# Altium schematic sheet SH4 - 5V VICOR DCDC.SchDoc: 5V Vicor DCDC
size B; CheckedBy: Lance Bantoto; Engineer: Cindy Li; Organization: UW Robotics; Address1: 200 University Avenue; Address2: Waterloo; Address3: Ontario; Address4: Canada N2L 3G6; DocumentNumber: 4; Revision: 2; SheetNumber: 4; SheetTotal: 10
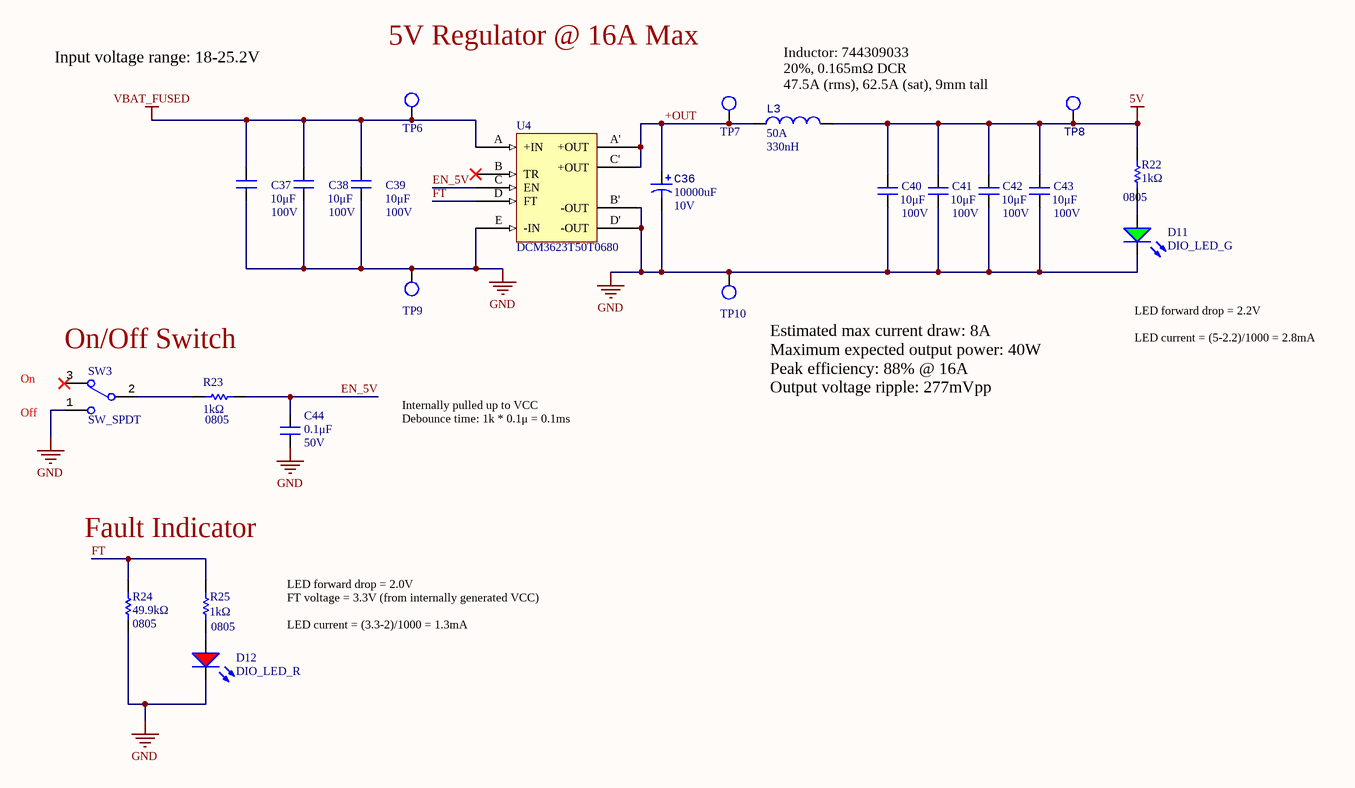
[diagram p0: SH4 - 5V VICOR DCDC.SchDoc]

## Parts
C36  Capacitance: 10000uF  Voltage Rating: 10V  [CAP_UBY_18X25_NC]  (hidden comment: URS1A103MHD1TN)
C37  value 10μF  Voltage Rating: 100V  [CAP1210]  (hidden comment: CAP_10uF_100V_1210)
C38  value 10μF  Voltage Rating: 100V  [CAP1210]  (hidden comment: CAP_10uF_100V_1210)
C39  value 10μF  Voltage Rating: 100V  [CAP1210]  (hidden comment: CAP_10uF_100V_1210)
C40  value 10μF  Voltage Rating: 100V  [CAP1210]  (hidden comment: CAP_10uF_100V_1210)
C41  value 10μF  Voltage Rating: 100V  [CAP1210]  (hidden comment: CAP_10uF_100V_1210)
C42  value 10μF  Voltage Rating: 100V  [CAP1210]  (hidden comment: CAP_10uF_100V_1210)
C43  value 10μF  Voltage Rating: 100V  [CAP1210]  (hidden comment: CAP_10uF_100V_1210)
C44  value 0.1μF  Voltage Rating: 50V  [CAP2012]  (hidden comment: CAP_0.1uF_50V_0805)
D11  DIO_LED_G  [LED_0805_GREEN]
D12  DIO_LED_R  [LED_0805_RED]
L3  Max DC Current: 50A  Inductance: 330nH  [WE-HCM 1390]  (hidden comment: 744309033)
R22  Resistance: 1kΩ  Package/Footprint: 0805  [RESC0805]  (hidden comment: RES_1kΩ_0805_1%)
R23  Resistance: 1kΩ  Package/Footprint: 0805  [RESC0805]  (hidden comment: RES_1kΩ_0805_1%)
R24  Resistance: 49.9kΩ  Package/Footprint: 0805  [RESC0805]  (hidden comment: RES_49.9kΩ_0805_1%)
R25  Resistance: 1kΩ  Package/Footprint: 0805  [RESC0805]  (hidden comment: RES_1kΩ_0805_1%)
SW3  SW_SPDT  [100SP1T1B4M2QE]
TP6  TESTPOINT_LOOP  [TESTPOINT_LOOP]  (value not drawn)
TP7  TESTPOINT_LOOP  [TESTPOINT_LOOP]  (value not drawn)
TP8  TESTPOINT_LOOP  [TESTPOINT_LOOP]  (value not drawn)
TP9  TESTPOINT_LOOP  [TESTPOINT_LOOP]  (value not drawn)
TP10  TESTPOINT_LOOP  [TESTPOINT_LOOP]  (value not drawn)
U4  DCM3623T50T0680  [DCM3623T50T0680]

## Nets
5V: C40.2 C41.2 C42.2 C43.2 L3.2 R22.2 TP8.1
GND: C36.2 C37.1 C38.1 C39.1 C40.1 C41.1 C42.1 C43.1 C44.1 D11.2(K) D12.2(K) R24.2 SW3.1 TP9.1 TP10.1 U4.B'(-OUT) U4.D'(-OUT) U4.E(-IN)
VBAT_FUSED: C37.2 C38.2 C39.2 TP6.1 U4.A(+IN)
+OUT: C36.1 L3.1 TP7.1 U4.A'(+OUT) U4.C'(+OUT)
EN_5V: C44.2 R23.2 U4.C(EN)
FT: R24.1 R25.2 U4.D(FT)
NetD11_1: D11.1(A) R22.1
NetD12_1: D12.1(A) R25.1
NetR23_1: R23.1 SW3.2

Not connected (* = marked no-connect by the designer): SW3 3*; U4 B(TR)*

## Notes on the sheet
- Input voltage range: 18-25.2V
- 5V Regulator @ 16A Max
- Inductor: 744309033
  20%, 0.165mΩ DCR
  47.5A (rms), 62.5A (sat), 9mm tall
- On
- On/Off Switch
- (near TP10) Estimated max current draw: 8A
  Maximum expected output power: 40W
  Peak efficiency: 88% @ 16A
  Output voltage ripple: 277mVpp
- LED forward drop = 2.2V
  LED current = (5-2.2)/1000 = 2.8mA
- (near SW3) Off
- Internally pulled up to VCC
  Debounce time: 1k * 0.1μ = 0.1ms
- Fault Indicator
- LED forward drop = 2.0V
  FT voltage = 3.3V (from internally generated VCC)
  LED current = (3.3-2)/1000 = 1.3mA
- Title:
- Project:
- Date:
- Rev:
- Reviewer:
- Engineer:
- Sheet:
- of

## Library data of the parts
C36 = URS1A103MHD1TN: CAP ALUM 10000UF 20% 10V RADIAL; Manufacturer 1: Nichicon; Ripple Current: 2.35A; Life (Hours): 2000Hour; Package/Footprint: TH; Supplier 1: Digi-Key; Manufacturer Part Number 1: URS1A103MHD1TN; Min Operating Temperature: -40°C; Max Operating Temperature: 85°C; Tolerance: 20%; Lead Pitch: 0.295inch; Height - Seated (Max): 1.043inch; Supplier Part Number 1: 493-12364-1-ND; Mounting Type: TH
C37-C43 = CAP_10uF_100V_1210: CAP CER 10uF 100V X7S 10% 1210; Manufacturer 1: Murata; Manufacturer Part Number 1: GRM32EC72A106KE05L; Package/Footprint: 1210; Supplier Part Number 1: 490-16266-1-ND; Supplier 1: Digi-Key; Dielectric: X7S; Tolerance: 10%; Mounting Type: SMD
C44 = CAP_0.1uF_50V_0805: CAP CER 0.1UF 50V X7R 0805; Manufacturer Part Number 1: GCM21BR71H104KA37K; Manufacturer 1: Murata Electronics; Tolerance: 10%; Package/Footprint: 0805; Supplier Part Number 1: 490-8049-1-ND; Supplier 1: Digi-Key; Mount: Surface Mount; Dielectric: X7R; Length: 2mm; Height: 1.25mm; Width: 0.049inch; Thickness: 0.049inch; Depth: 1.25mm; Ratings: AEC-Q200; LCSC Part #: C49678; Mounting Type: SMD
D11 = DIO_LED_G: LED GREEN DIFFUSED 0805 SMD; Manufacturer Part Number 1: LG R971-KN-1; Manufacturer 1: OSRAM; Forward Voltage Drop: 2.2V; Package/Footprint: 0805; Supplier Part Number 1: 475-1410-1-ND; Supplier 1: Digi-Key; Mounting Type: SMD
D12 = DIO_LED_R: LED RED DIFFUSED 0805 SMD; Manufacturer Part Number 1: LS R976-NR-1; Manufacturer 1: OSRAM; Forward Voltage Drop: 2V; Package/Footprint: 0805; Supplier Part Number 1: 475-1278-1-ND; Supplier 1: Digi-Key; Mounting Type: SMD
L3 = 744309033: IND 330NH 47.5A 0.165 MOHM; Manufacturer 1: Wurth Electronics; Core Material: Zinc; Inductance Tolerance: 20%; Self Resonant Frequency: 158MHz; Saturation Current: 62.5A; Shielding: Shielded; DC Resistance (DCR): 0.165mR; Test Frequency: 100kHz; Package/Footprint: SMD; Supplier 1: Digi-Key; Manufacturer Part Number 1: 744309033; Min Operating Temperature: -40°C; Max Operating Temperature: 125°C; Current Rating: 47.5A; Tolerance: 20%; Composition: Wirewound; Termination: SMD/SMT; RMS Current (Irms): 50A; Length: 0.551inch; Height: 9mm; Width: 0.512inch; Height - Seated (Max): 0.374inch; REACH SVHC: Unknown; Supplier Part Number 1: 732-3006-1-ND; Mounting Type: SMD
R22 R23 R25 = RES_1kΩ_0805_1%: RES 1K OHM 1% 1/8W 0805; Manufacturer 1: Yageo; Manufacturer Part Number 1: RC0805FR-071KL; Tolerance: 1%; Supplier Part Number 1: 311-1.00KCRCT-ND; Supplier 1: Digi-Key; LCSC Part #: C17513; Mounting Type: SMD
R24 = RES_49.9kΩ_0805_1%: RES 49.9K OHM 1% 1/8W 0805; Manufacturer Part Number 1: TNPW080549K9BEEN; Manufacturer 1: Vishay Dale; Supplier 1: Digi-Key; Supplier Part Number 1: 541-3802-1-ND; Tolerance: 1%; LCSC Part #: C17719; Mounting Type: SMD
SW3 = SW_SPDT: SWITCH TOGGLE SPDT 5A 120V; Manufacturer 1: E-Switch; Voltage Rating (DC): 28V; Package/Footprint: TH; Supplier 1: Digi-Key; Manufacturer Part Number 1: 100SP1T1B4M2QE; Throw Configuration: SPDT; Supplier Part Number 1: EG2355-ND; Current Rating: 5A; Mounting Type: TH
TP6-TP10 = TESTPOINT_LOOP: PC TEST POINT MINIATURE WHITE; Manufacturer 1: Keystone Electronics; Manufacturer Part Number 1: 5002; Package/Footprint: TH; Supplier 1: Digi-Key; Supplier Part Number 1: 36-5002-ND; Mounting Type: TH
U4 = DCM3623T50T0680: DC DC CONVERTER 5V 80W; Manufacturer 1: Vicor Corporation; Manufacturer Part Number 1: DCM3623T50T0680T00; Package/Footprint: TH; Supplier 1: Digi-Key; Supplier Part Number 1: 1102-5585-ND; Mounting Type: TH